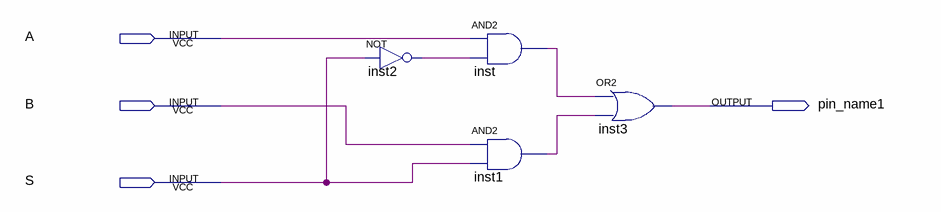
[diagram p0: schematic sheet]
// Quartus schematic MUX1BIT.bdf as structural Verilog: 4 symbols, 4 pins
module MUX1BIT (
  input  A,
  input  B,
  input  S,
  output pin_name1
);

  wire inst1_out, inst2_out, inst_out;

  not inst2 (inst2_out, S);
  and inst (inst_out, A, inst2_out);
  and inst1 (inst1_out, B, S);
  or inst3 (pin_name1, inst_out, inst1_out);
endmodule
